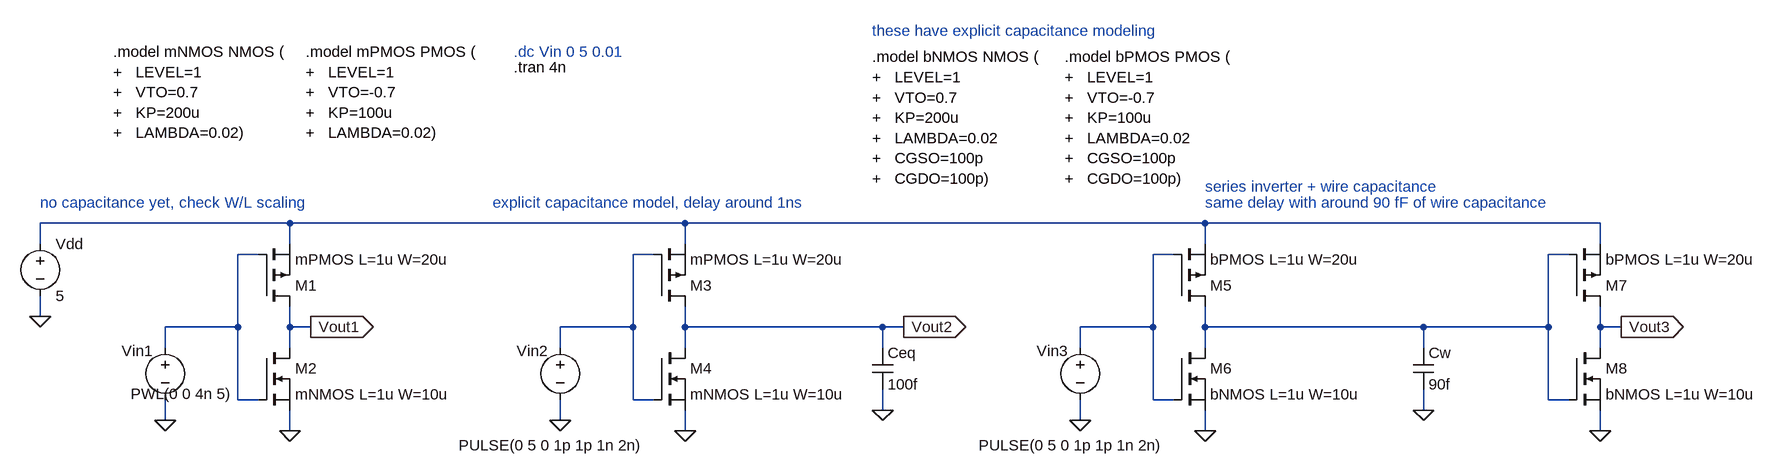
[diagram p0: schematic cmos_inv_properties.asc]
cmos_inv_properties.asc, the LTspice schematic file:
Version 4.1
SHEET 1 2640 712
WIRE 368 320 -16 320
WIRE 976 320 368 320
WIRE 1776 320 976 320
WIRE 2384 320 1776 320
WIRE -16 352 -16 320
WIRE 368 352 368 320
WIRE 976 352 976 320
WIRE 1776 352 1776 320
WIRE 2384 352 2384 320
WIRE 320 368 288 368
WIRE 928 368 896 368
WIRE 1728 368 1696 368
WIRE 2336 368 2304 368
WIRE -16 464 -16 432
WIRE 288 480 288 368
WIRE 288 480 176 480
WIRE 368 480 368 448
WIRE 400 480 368 480
WIRE 896 480 896 368
WIRE 896 480 784 480
WIRE 976 480 976 448
WIRE 1280 480 976 480
WIRE 1312 480 1280 480
WIRE 1696 480 1696 368
WIRE 1696 480 1584 480
WIRE 1776 480 1776 448
WIRE 2112 480 1776 480
WIRE 2304 480 2304 368
WIRE 2304 480 2112 480
WIRE 2384 480 2384 448
WIRE 2416 480 2384 480
WIRE 176 512 176 480
WIRE 368 512 368 480
WIRE 784 512 784 480
WIRE 976 512 976 480
WIRE 1280 512 1280 480
WIRE 1584 512 1584 480
WIRE 1776 512 1776 480
WIRE 2112 512 2112 480
WIRE 2384 512 2384 480
WIRE 288 592 288 480
WIRE 320 592 288 592
WIRE 896 592 896 480
WIRE 928 592 896 592
WIRE 1696 592 1696 480
WIRE 1728 592 1696 592
WIRE 2304 592 2304 480
WIRE 2336 592 2304 592
WIRE 1280 608 1280 576
WIRE 2112 608 2112 576
WIRE 176 624 176 592
WIRE 784 624 784 592
WIRE 1584 624 1584 592
WIRE 368 640 368 608
WIRE 976 640 976 608
WIRE 1776 640 1776 608
WIRE 2384 640 2384 608
FLAG 400 480 Vout1
IOPIN 400 480 Out
FLAG 368 640 0
FLAG -16 464 0
FLAG 176 624 0
FLAG 976 640 0
FLAG 784 624 0
FLAG 1280 608 0
FLAG 1312 480 Vout2
IOPIN 1312 480 Out
FLAG 1776 640 0
FLAG 1584 624 0
FLAG 2384 640 0
FLAG 2416 480 Vout3
IOPIN 2416 480 Out
FLAG 2112 608 0
SYMBOL pmos 320 448 M180
SYMATTR InstName M1
SYMATTR Value mPMOS L=1u W=20u
SYMBOL nmos 320 512 R0
SYMATTR InstName M2
SYMATTR Value mNMOS L=1u W=10u
SYMBOL voltage -16 336 R0
SYMATTR InstName Vdd
SYMATTR Value 5
SYMBOL voltage 176 496 R0
WINDOW 0 -67 21 Left 2
WINDOW 3 -53 87 Left 2
WINDOW 123 0 0 Left 0
WINDOW 39 0 0 Left 0
SYMATTR InstName Vin1
SYMATTR Value PWL(0 0 4n 5)
SYMBOL pmos 928 448 M180
SYMATTR InstName M3
SYMATTR Value mPMOS L=1u W=20u
SYMBOL nmos 928 512 R0
SYMATTR InstName M4
SYMATTR Value mNMOS L=1u W=10u
SYMBOL voltage 784 496 R0
WINDOW 0 -67 21 Left 2
WINDOW 3 -156 166 Left 2
WINDOW 123 0 0 Left 0
WINDOW 39 0 0 Left 0
SYMATTR InstName Vin2
SYMATTR Value PULSE(0 5 0 1p 1p 1n 2n)
SYMBOL cap 1264 512 R0
SYMATTR InstName Ceq
SYMATTR Value 100f
SYMBOL pmos 1728 448 M180
SYMATTR InstName M5
SYMATTR Value bPMOS L=1u W=20u
SYMBOL nmos 1728 512 R0
SYMATTR InstName M6
SYMATTR Value bNMOS L=1u W=10u
SYMBOL pmos 2336 448 M180
SYMATTR InstName M7
SYMATTR Value bPMOS L=1u W=20u
SYMBOL nmos 2336 512 R0
SYMATTR InstName M8
SYMATTR Value bNMOS L=1u W=10u
SYMBOL voltage 1584 496 R0
WINDOW 0 -67 21 Left 2
WINDOW 3 -156 166 Left 2
WINDOW 123 0 0 Left 0
WINDOW 39 0 0 Left 0
SYMATTR InstName Vin3
SYMATTR Value PULSE(0 5 0 1p 1p 1n 2n)
SYMBOL cap 2096 512 R0
SYMATTR InstName Cw
SYMATTR Value 90f
TEXT 96 56 Left 2 !.model mNMOS NMOS (\n+   LEVEL=1\n+   VTO=0.7\n+   KP=200u\n+   LAMBDA=0.02)
TEXT 392 56 Left 2 !.model mPMOS PMOS (\n+   LEVEL=1\n+   VTO=-0.7\n+   KP=100u\n+   LAMBDA=0.02)
TEXT 712 56 Left 2 ;.dc Vin 0 5 0.01
TEXT 712 80 Left 2 !.tran 4n
TEXT -16 288 Left 2 ;no capacitance yet, check W/L scaling
TEXT 680 288 Left 2 ;explicit capacitance model, delay around 1ns
TEXT 1264 64 Left 2 !.model bNMOS NMOS (\n+   LEVEL=1\n+   VTO=0.7\n+   KP=200u\n+   LAMBDA=0.02\n+   CGSO=100p\n+   CGDO=100p)
TEXT 1560 64 Left 2 !.model bPMOS PMOS (\n+   LEVEL=1\n+   VTO=-0.7\n+   KP=100u\n+   LAMBDA=0.02\n+   CGSO=100p\n+   CGDO=100p)
TEXT 1264 24 Left 2 ;these have explicit capacitance modeling
TEXT 1776 264 Left 2 ;series inverter + wire capacitance
TEXT 1776 288 Left 2 ;same delay with around 90 fF of wire capacitance

The netlist it stands for:
* cmos_inv_properties.asc
M1 Vout1 N002 N001 N001 mPMOS L=1u W=20u
M2 Vout1 N002 0 0 mNMOS L=1u W=10u
Vdd N001 0 5
Vin1 N002 0 PWL(0 0 4n 5)
M3 Vout2 N003 N001 N001 mPMOS L=1u W=20u
M4 Vout2 N003 0 0 mNMOS L=1u W=10u
Vin2 N003 0 PULSE(0 5 0 1p 1p 1n 2n)
Ceq Vout2 0 100f
M5 N005 N004 N001 N001 bPMOS L=1u W=20u
M6 N005 N004 0 0 bNMOS L=1u W=10u
M7 Vout3 N005 N001 N001 bPMOS L=1u W=20u
M8 Vout3 N005 0 0 bNMOS L=1u W=10u
Vin3 N004 0 PULSE(0 5 0 1p 1p 1n 2n)
Cw N005 0 90f
.model NMOS NMOS
.model PMOS PMOS
.lib standard.mos
.model mNMOS NMOS (
+   LEVEL=1
+   VTO=0.7
+   KP=200u
+   LAMBDA=0.02)
.model mPMOS PMOS (
+   LEVEL=1
+   VTO=-0.7
+   KP=100u
+   LAMBDA=0.02)
* .dc Vin 0 5 0.01
.tran 4n
* no capacitance yet, check W/L scaling
* explicit capacitance model, delay around 1ns
.model bNMOS NMOS (
+   LEVEL=1
+   VTO=0.7
+   KP=200u
+   LAMBDA=0.02
+   CGSO=100p
+   CGDO=100p)
.model bPMOS PMOS (
+   LEVEL=1
+   VTO=-0.7
+   KP=100u
+   LAMBDA=0.02
+   CGSO=100p
+   CGDO=100p)
* these have explicit capacitance modeling
* series inverter + wire capacitance
* same delay with around 90 fF of wire capacitance
.backanno
.end

* Results of the author's LTspice run, read from the files saved beside the schematic
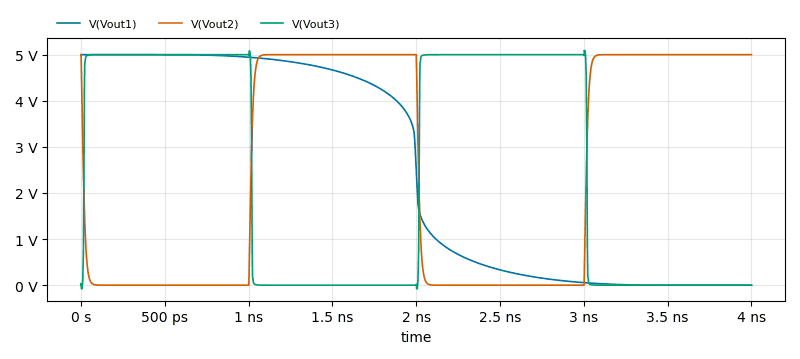
[diagram p1: Transient Analysis of cmos_inv_properties.asc, plotted from the saved traces]
* Transient Analysis, 1 run:
*   V(Vout1): min 0 V, max 5 V, average 2.5 V, rms 3.392 V, last 0 V
*   V(Vout2): min 0 V, max 5 V, average 2.498 V, rms 3.509 V, last 5 V
*   V(Vout3): min -78.49 mV, max 5.093 V, average 2.502 V, rms 3.531 V, last 0 V